# Altium schematic sheet 51-2001-01-6_04 Power Module Schematic.SchDoc
size 431 x 279 mm; Organization: ORGANIZATION; Address1: ADDRESS 1; Address2: ADDRESS 2; Address3: ADDRESS 3; Address4: ADDRESS 4; Revision: -; SheetNumber: 4; SheetTotal: 4; ENG_APP_DATE: --/--/--; DSN_APP_DATE: --/--/--; CHK_APP_DATE: --/--/--
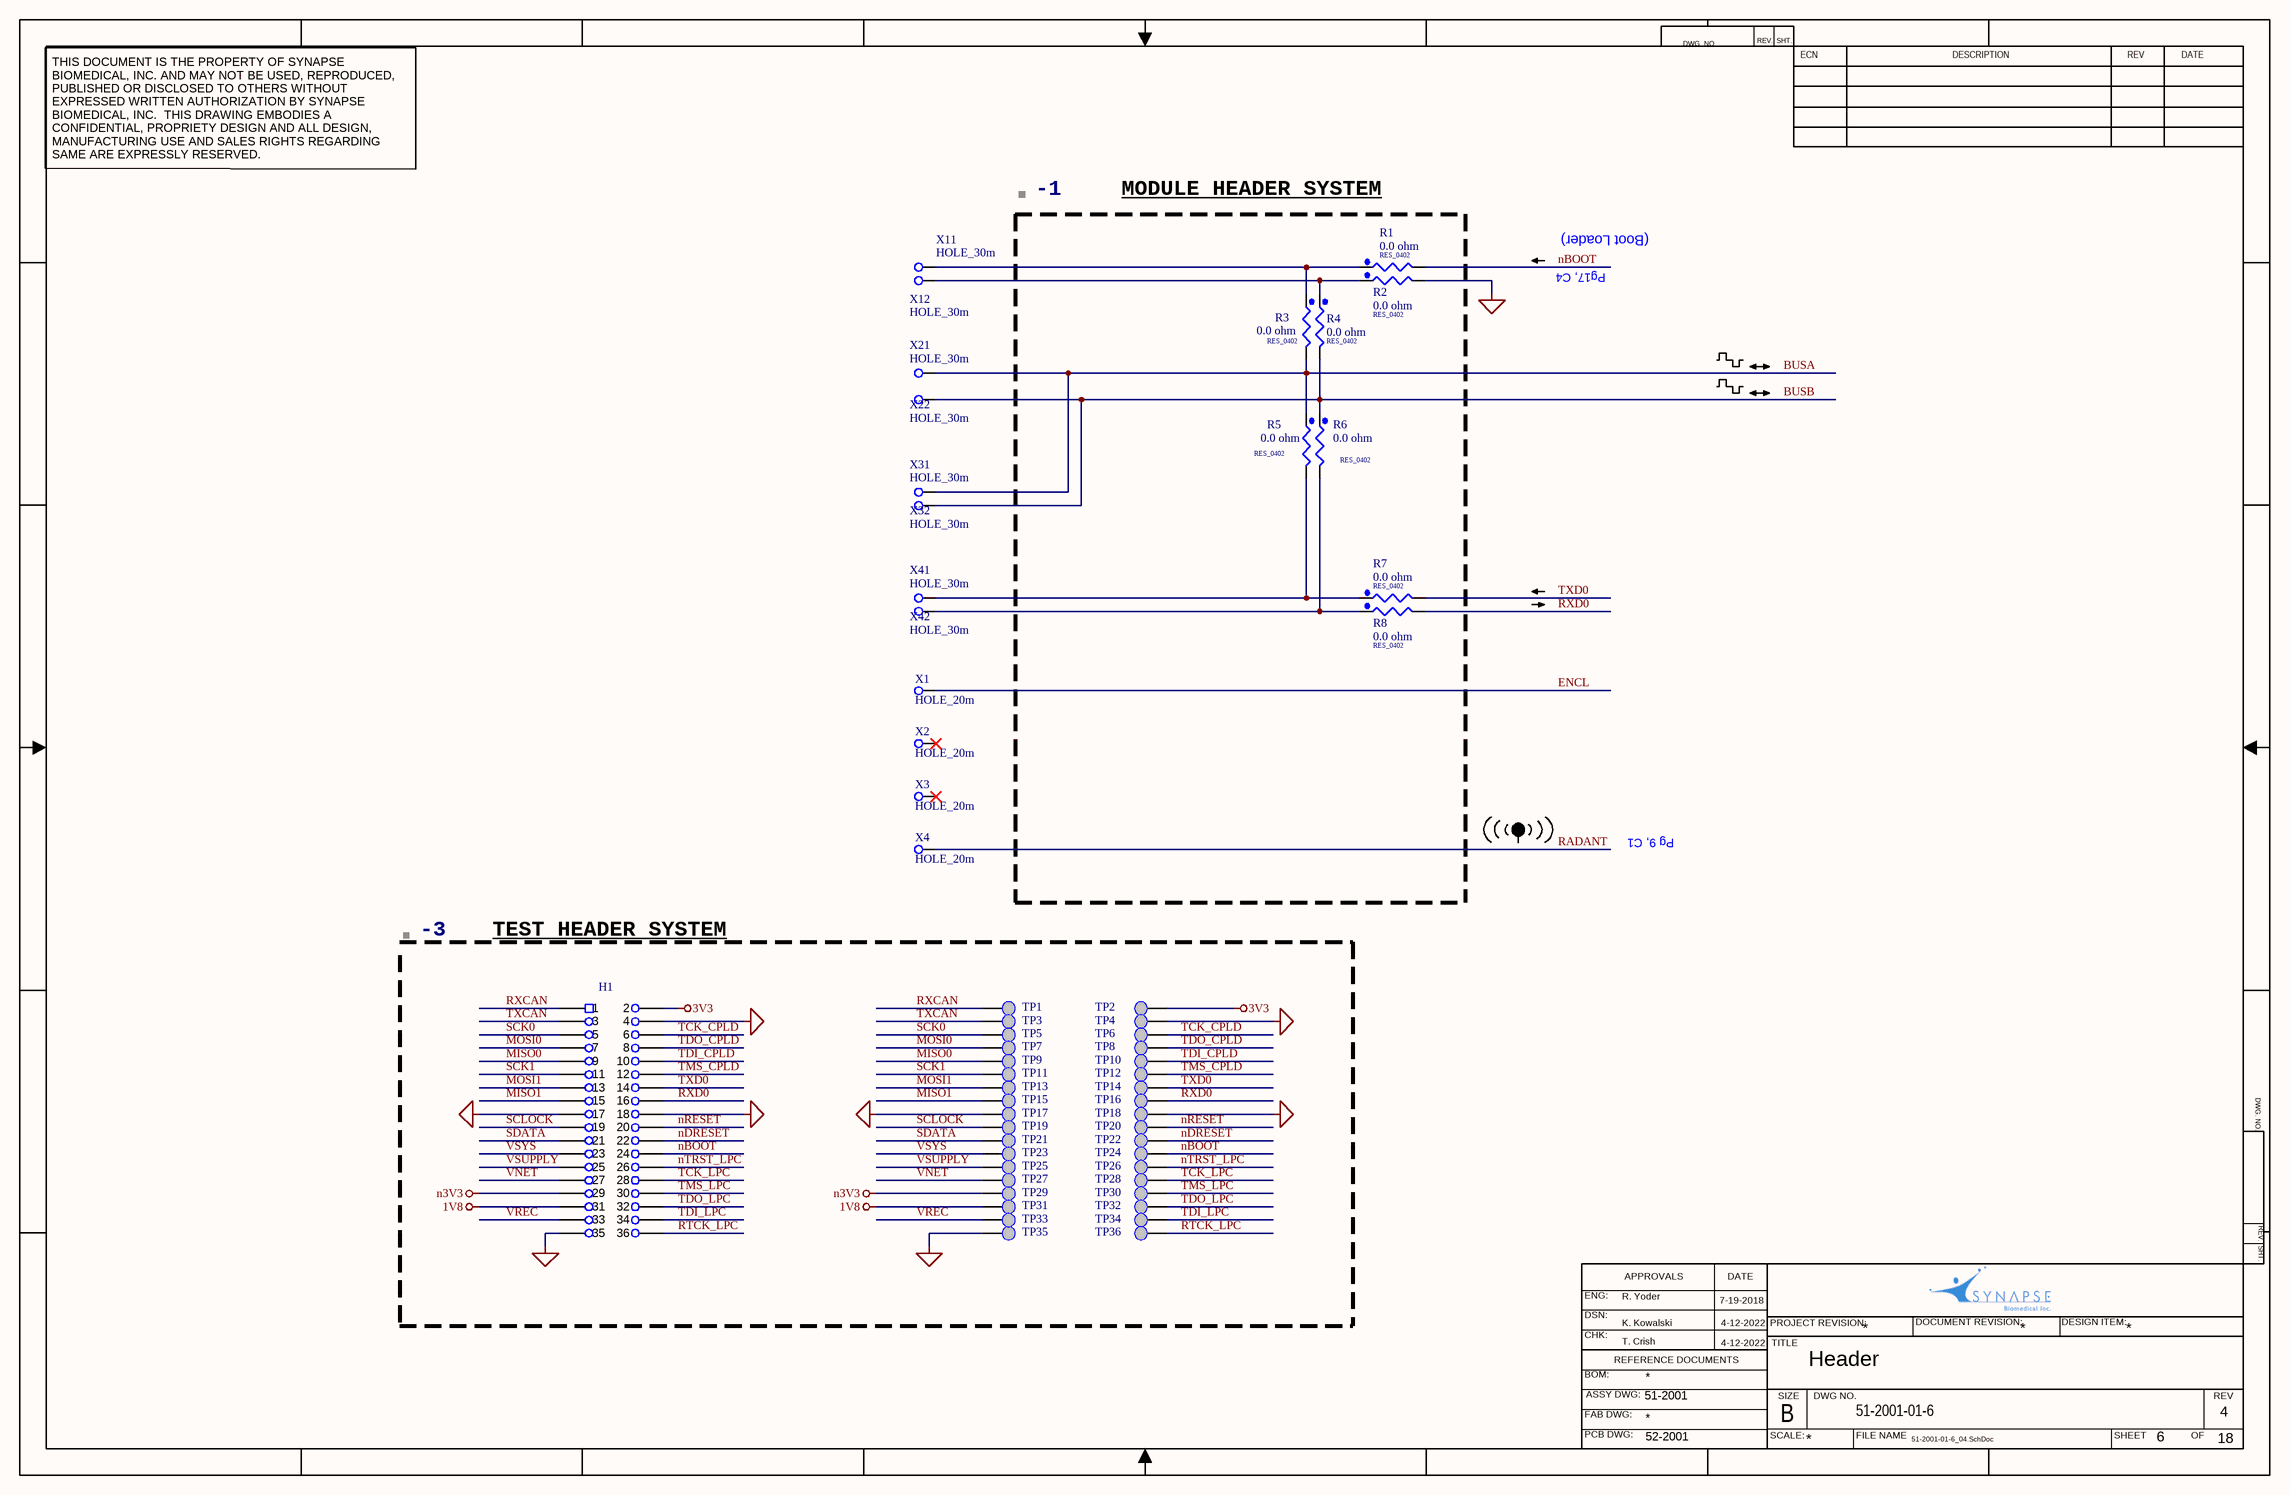
[diagram p0: 51-2001-01-6_04 Power Module Schematic.SchDoc]

## Parts
-1  XDESCRIPTION: MODULE HEADER SYSTEM  (hidden comment: BOM_S1)  (graphical)
-3  XDESCRIPTION: TEST HEADER SYSTEM  (hidden comment: BOM_S1)  (graphical)
H1  0.1"  [HEADER36]  (value not drawn)  (no BOM)
R1  value 0.0 ohm  [RES_0402]  (hidden comment: R_0_0402)
R2  value 0.0 ohm  [RES_0402]  (hidden comment: R_0_0402)
R3  value 0.0 ohm  [RES_0402]  (hidden comment: R_0_0402)
R4  value 0.0 ohm  [RES_0402]  (hidden comment: R_0_0402)
R5  value 0.0 ohm  [RES_0402]  (hidden comment: R_0_0402)
R6  value 0.0 ohm  [RES_0402]  (hidden comment: R_0_0402)
R7  value 0.0 ohm  [RES_0402]  (hidden comment: R_0_0402)
R8  value 0.0 ohm  [RES_0402]  (hidden comment: R_0_0402)
TP1  Test Point  [TEST_POINT]  (value not drawn)  (no BOM)
TP2  Test Point  [TEST_POINT]  (value not drawn)  (no BOM)
TP3  Test Point  [TEST_POINT]  (value not drawn)  (no BOM)
TP4  Test Point  [TEST_POINT]  (value not drawn)  (no BOM)
TP5  Test Point  [TEST_POINT]  (value not drawn)  (no BOM)
TP6  Test Point  [TEST_POINT]  (value not drawn)  (no BOM)
TP7  Test Point  [TEST_POINT]  (value not drawn)  (no BOM)
TP8  Test Point  [TEST_POINT]  (value not drawn)  (no BOM)
TP9  Test Point  [TEST_POINT]  (value not drawn)  (no BOM)
TP10  Test Point  [TEST_POINT]  (value not drawn)  (no BOM)
TP11  Test Point  [TEST_POINT]  (value not drawn)  (no BOM)
TP12  Test Point  [TEST_POINT]  (value not drawn)  (no BOM)
TP13  Test Point  [TEST_POINT]  (value not drawn)  (no BOM)
TP14  Test Point  [TEST_POINT]  (value not drawn)  (no BOM)
TP15  Test Point  [TEST_POINT]  (value not drawn)  (no BOM)
TP16  Test Point  [TEST_POINT]  (value not drawn)  (no BOM)
TP17  Test Point  [TEST_POINT]  (value not drawn)  (no BOM)
TP18  Test Point  [TEST_POINT]  (value not drawn)  (no BOM)
TP19  Test Point  [TEST_POINT]  (value not drawn)  (no BOM)
TP20  Test Point  [TEST_POINT]  (value not drawn)  (no BOM)
TP21  Test Point  [TEST_POINT]  (value not drawn)  (no BOM)
TP22  Test Point  [TEST_POINT]  (value not drawn)  (no BOM)
TP23  Test Point  [TEST_POINT]  (value not drawn)  (no BOM)
TP24  Test Point  [TEST_POINT]  (value not drawn)  (no BOM)
TP25  Test Point  [TEST_POINT]  (value not drawn)  (no BOM)
TP26  Test Point  [TEST_POINT]  (value not drawn)  (no BOM)
TP27  Test Point  [TEST_POINT]  (value not drawn)  (no BOM)
TP28  Test Point  [TEST_POINT]  (value not drawn)  (no BOM)
TP29  Test Point  [TEST_POINT]  (value not drawn)  (no BOM)
TP30  Test Point  [TEST_POINT]  (value not drawn)  (no BOM)
TP31  Test Point  [TEST_POINT]  (value not drawn)  (no BOM)
TP32  Test Point  [TEST_POINT]  (value not drawn)  (no BOM)
TP33  Test Point  [TEST_POINT]  (value not drawn)  (no BOM)
TP34  Test Point  [TEST_POINT]  (value not drawn)  (no BOM)
TP35  Test Point  [TEST_POINT]  (value not drawn)  (no BOM)
TP36  Test Point  [TEST_POINT]  (value not drawn)  (no BOM)
X1  HOLE_20m  [FEEDHOLE_20mil]  (no BOM)
X2  HOLE_20m  [FEEDHOLE_20mil]  (no BOM)
X3  HOLE_20m  [FEEDHOLE_20mil]  (no BOM)
X4  HOLE_20m  [FEEDHOLE_20mil]  (no BOM)
X11  HOLE_30m  [FEEDHOLE_30mil]  (no BOM)
X12  HOLE_30m  [FEEDHOLE_30mil]  (no BOM)
X21  HOLE_30m  [FEEDHOLE_30mil]  (no BOM)
X22  HOLE_30m  [FEEDHOLE_30mil]  (no BOM)
X31  HOLE_30m  [FEEDHOLE_30mil]  (no BOM)
X32  HOLE_30m  [FEEDHOLE_30mil]  (no BOM)
X41  HOLE_30m  [FEEDHOLE_30mil]  (no BOM)
X42  HOLE_30m  [PCBComponent_11]  (no BOM)

## Nets
1V8: H1.31 TP31.1(TP)
3V3: H1.2 TP2.1(TP)
GND: H1.4 H1.17 H1.18 H1.35 R2.2 TP4.1(TP) TP17.1(TP) TP18.1(TP) TP35.1(TP)
n3V3: H1.29 TP29.1(TP)
BUSA: R3.2 R5.1 X21.1 X31.1
BUSB: R4.2 R6.1 X22.1 X32.1
ENCL: X1.1
MISO0: H1.9 TP9.1(TP)
MISO1: H1.15 TP15.1(TP)
MOSI0: H1.7 TP7.1(TP)
MOSI1: H1.13 TP13.1(TP)
nBOOT: H1.24 R1.2 TP24.1(TP)
nDRESET: H1.22 TP22.1(TP)
nRESET: H1.20 TP20.1(TP)
nTRST_LPC: H1.26 TP26.1(TP)
RADANT: X4.1
RTCK_LPC: H1.36 TP36.1(TP)
RXCAN: H1.1 TP1.1(TP)
RXD0: H1.16 R8.2 TP16.1(TP)
SCK0: H1.5 TP5.1(TP)
SCK1: H1.11 TP11.1(TP)
SCLOCK: H1.19 TP19.1(TP)
SDATA: H1.21 TP21.1(TP)
TCK_CPLD: H1.6 TP6.1(TP)
TCK_LPC: H1.28 TP28.1(TP)
TDI_CPLD: H1.10 TP10.1(TP)
TDI_LPC: H1.34 TP34.1(TP)
TDO_CPLD: H1.8 TP8.1(TP)
TDO_LPC: H1.32 TP32.1(TP)
TMS_CPLD: H1.12 TP12.1(TP)
TMS_LPC: H1.30 TP30.1(TP)
TXCAN: H1.3 TP3.1(TP)
TXD0: H1.14 R7.2 TP14.1(TP)
VNET: H1.27 TP27.1(TP)
VREC: H1.33 TP33.1(TP)
VSUPPLY: H1.25 TP25.1(TP)
VSYS: H1.23 TP23.1(TP)
NetR1_1: R1.1 R3.1 X11.1
NetR2_1: R2.1 R4.1 X12.1
NetR5_2: R5.2 R7.1 X41.1
NetR6_2: R6.2 R8.1 X42.1

Not connected (* = marked no-connect by the designer): X2 1*; X3 1*

## Notes on the sheet
- DWG. NO.
- REV.
- SHT.
- ECN
- DESCRIPTION
- REV
- DATE
- THIS DOCUMENT IS THE PROPERTY OF SYNAPSE BIOMEDICAL, INC. AND MAY NOT BE USED, REPRODUCED, PUBLISHED OR DISCLOSED TO OTHERS WITHOUT EXPRESSED WRITTEN AUTHORIZATION BY SYNAPSE BIOMEDICAL, INC.  THIS DRAWING EMBODIES A CONFIDENTIAL, PROPRIETY DESIGN AND ALL DESIGN, MANUFACTURING USE AND SALES RIGHTS REGARDING SAME ARE EXPRESSLY RESERVED.
- (Boot Loader)
- Pg17, C4
- Pg 9, C1
- ENG:
- R. Yoder
- APPROVALS
- 7-19-2018
- DSN:
- CHK:
- REFERENCE DOCUMENTS
- K. Kowalski
- T. Crish
- 4-12-2022
- PROJECT REVISION:
- TITLE
- Header
- *
- DOCUMENT REVISION:
- DESIGN ITEM:
- BOM:
- FAB DWG:
- PCB DWG:
- ASSY DWG:
- 51-2001
- SCALE:
- SIZE
- B
- DWG NO.
- 51-2001-01-6
- FILE NAME
- SHEET
- OF
- 4
- 52-2001
- 51-2001-01-6_04.SchDoc
- 6
- 18

## Library data of the parts
-1 -3 = BOM_S1: BOM item small graphic
H1 = Header 2X18: 0.1" Header; PackageDescription: Thru-Hole
R1-R8 = MCR01MZPJ000: 0.0 ohm, 1/16W, 0402, RoHS; MFR: Vishay Dale; MPN: CRCW04021K00FKED; SBI: 53-0048; PackageDescription: RES_0402; Supplier 1: Digi-Key; Supplier Part Number 1: 541-1.00KLDKR-ND
TP1-TP36 = TP: Test Point Pad 1.00 mm; Value: *; Package: *; Manufacturer: *; Partnumber: *
X1-X4 = HOLE_20m: Hole for 10mil diameter feedthrough; Note: Hole for 10mil diameter feedthrough; PackageDescription: Thru-Hole
X11 X12 X21 X22 X31 X32 X41 X42 = HOLE_30m: Hole 30mil; PackageDescription: Thru-Hole